# EAGLE schematic wzium (EAGLE 9.6.2)
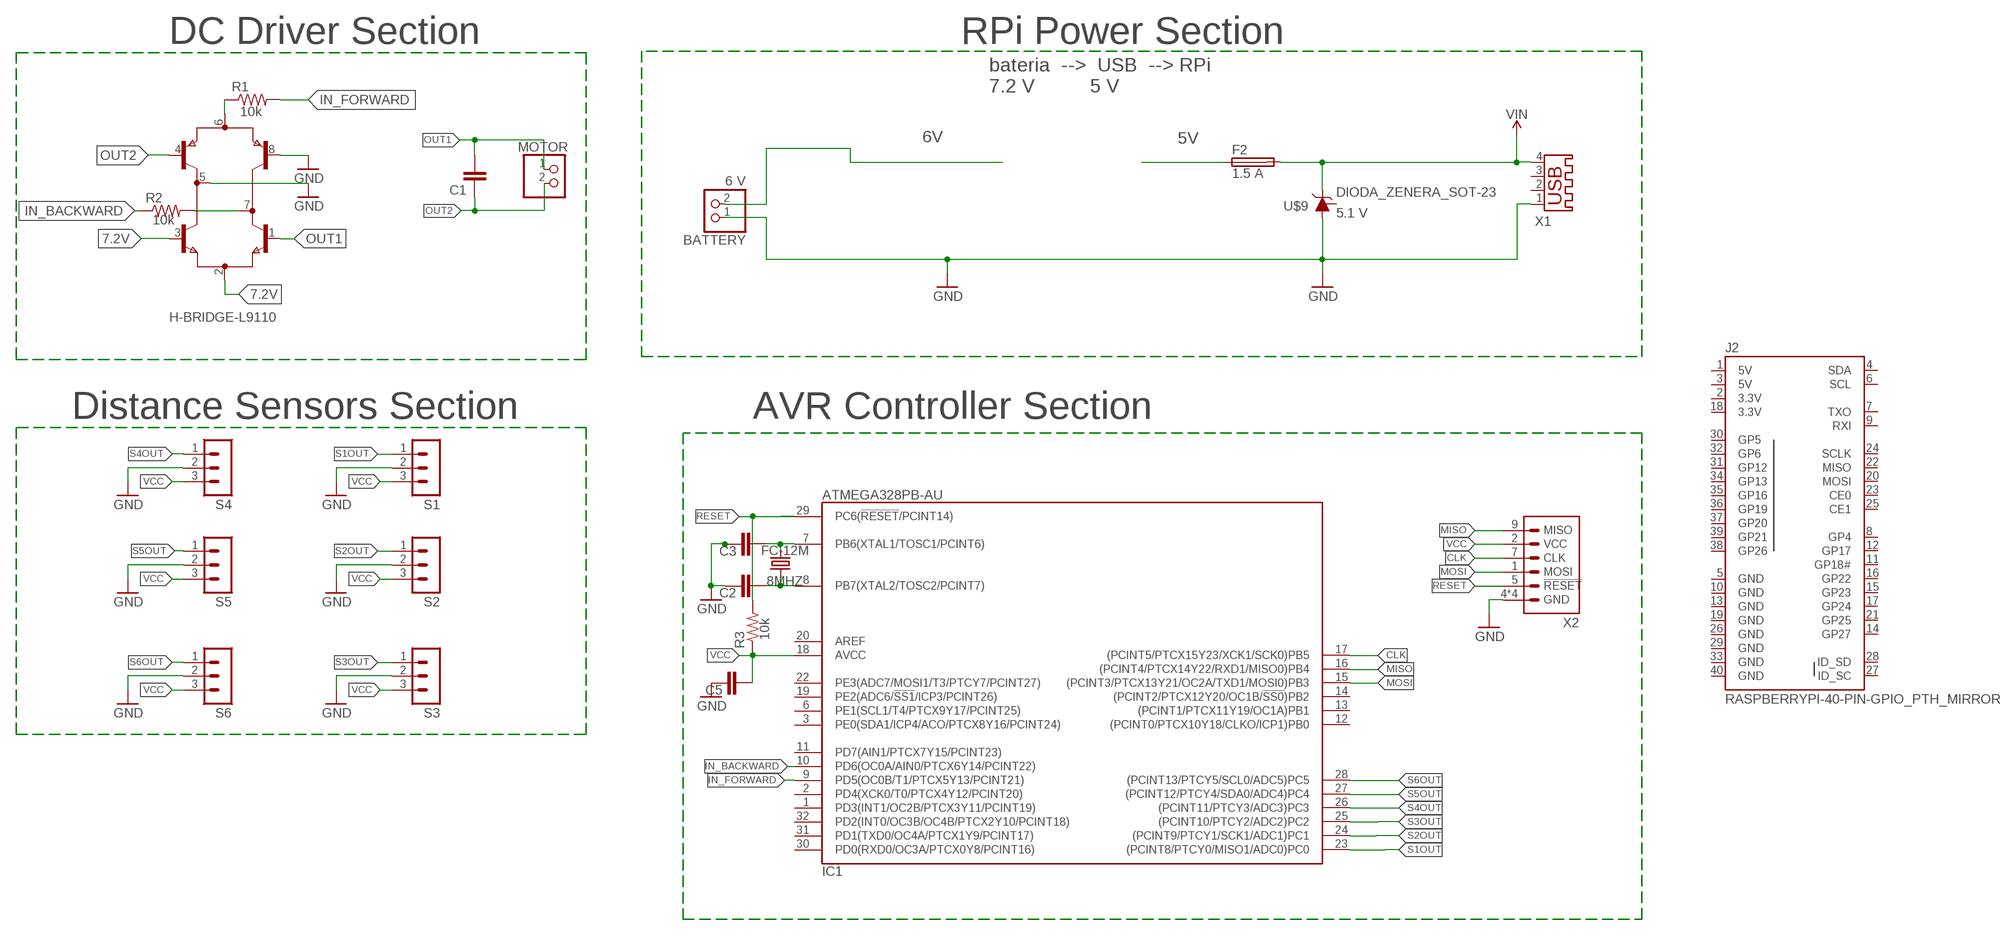
[diagram p0: schematic, sheet 1]

## Parts
8MHZ  FC-12M  [FC-12M]
BATTERY  6 V  PINHD-1X2  [1X02]
C1  C-EUC0805  [C0805]
C2  C-EUC0805  [C0805]
C3  C-EUC0805  [C0805]
C5  C-EUC0805  [C0805]
F2  1.5 A  SH22,5  [SH22,5]
H-BRIDGE-L9110  H-BRIDGE  [SM8]
IC1  ATMEGA328PB-AU  [QFP32_7X7_0.80]
J2  RASPBERRYPI-40-PIN-GPIO_PTH_MIRROR  [2X20_SHROUDED]
MOTOR  PINHD-1X2  [1X02]
R1  10k  R-US_R0805  [R0805]
R2  10k  R-US_R0805  [R0805]
R3  10k  R-US_R0805  [R0805]
S1  MA03-1  [MA03-1]
S2  MA03-1  [MA03-1]
S3  MA03-1  [MA03-1]
S4  MA03-1  [MA03-1]
S5  MA03-1  [MA03-1]
S6  MA03-1  [MA03-1]
U$9  DIODA_ZENERA_SOT-23  [SOT23-3]
X1  USB-A003  [USB-A003]
X2  MISO_MOSIIDC-10V  [IDC-10V]

## Nets
5V: F2.1
6V: BATTERY.2
7.2V: H-BRIDGE-L9110.2(E2E3) H-BRIDGE-L9110.3(B2)
CLK: IC1.17((PCINT5/PTCX15Y23/XCK1/SCK0)PB5) X2.7(CLK)
GND: BATTERY.1 C2.2 C3.2 C5.2 H-BRIDGE-L9110.5(C1C2) H-BRIDGE-L9110.8(B4) S1.2 S2.2 S3.2 S4.2 S5.2 S6.2 U$9.1(A) X1.1 X2.4(GND) X2.6(GND) X2.8(GND) X2.10(GND)
IN_BACKWARD: IC1.10(PD6(OC0A/AIN0/PTCX6Y14/PCINT22)) R2.1
IN_FORWARD: IC1.9(PD5(OC0B/T1/PTCX5Y13/PCINT21)) R1.2
MISO: IC1.16((PCINT4/PTCX14Y22/RXD1/MISO0)PB4) X2.9(MISO)
MOSI: IC1.15((PCINT3/PTCX13Y21/OC2A/TXD1/MOSI0)PB3) X2.1(MOSI)
N$3: H-BRIDGE-L9110.7(C3C4) R2.2
N$5: H-BRIDGE-L9110.6(E1E4) R1.1
N$7: 8MHZ.1 C3.1 IC1.7(PB6(XTAL1/TOSC1/PCINT6))
N$8: 8MHZ.2 C2.1 IC1.8(PB7(XTAL2/TOSC2/PCINT7))
OUT1: C1.2 H-BRIDGE-L9110.1(B3) MOTOR.1
OUT2: C1.1 H-BRIDGE-L9110.4(B1) MOTOR.2
RESET: IC1.29(PC6(!RESET!/PCINT14)) R3.2 X2.5(!RESET)
S1OUT: IC1.23((PCINT8/PTCY0/MISO1/ADC0)PC0) S1.1
S2OUT: IC1.24((PCINT9/PTCY1/SCK1/ADC1)PC1) S2.1
S3OUT: IC1.25((PCINT10/PTCY2/ADC2)PC2) S3.1
S4OUT: IC1.26((PCINT11/PTCY3/ADC3)PC3) S4.1
S5OUT: IC1.27((PCINT12/PTCY4/SDA0/ADC4)PC4) S5.1
S6OUT: IC1.28((PCINT13/PTCY5/SCL0/ADC5)PC5) S6.1
VCC: C5.1 IC1.18(AVCC) R3.1 S1.3 S2.3 S3.3 S4.3 S5.3 S6.3 X2.2(VCC)
VIN: F2.2 U$9.3(C) X1.4
Unconnected: IC1.1(PD3(INT1/OC2B/PTCX3Y11/PCINT19)) IC1.2(PD4(XCK0/T0/PTCX4Y12/PCINT20)) IC1.3(PE0(SDA1/ICP4/ACO/PTCX8Y16/PCINT24)) IC1.6(PE1(SCL1/T4/PTCX9Y17/PCINT25)) IC1.11(PD7(AIN1/PTCX7Y15/PCINT23)) IC1.12((PCINT0/PTCX10Y18/CLKO/ICP1)PB0) IC1.13((PCINT1/PTCX11Y19/OC1A)PB1) IC1.14((PCINT2/PTCX12Y20/OC1B/!SS0!)PB2) IC1.19(PE2(ADC6/!SS1!/ICP3/PCINT26)) IC1.20(AREF) IC1.22(PE3(ADC7/MOSI1/T3/PTCY7/PCINT27)) IC1.30(PD0(RXD0/OC3A/PTCX0Y8/PCINT16)) IC1.31(PD1(TXD0/OC4A/PTCX1Y9/PCINT17)) IC1.32(PD2(INT0/OC3B/OC4B/PTCX2Y10/PCINT18)) J2.4(SDA) J2.6(SCL) J2.7(TXO) J2.8(GP4) J2.9(RXI) J2.11(GP18#) J2.12(GP17) J2.14(GP27) J2.15(GP23) J2.16(GP22) J2.17(GP24) J2.20(MOSI) J2.21(GP25) J2.22(MISO) J2.23(CE0) J2.24(SCLK) J2.25(CE1) J2.27(ID_SC) J2.28(ID_SD) J2.30(GP5) J2.31(GP12) J2.32(GP6) J2.34(GP13) J2.35(GP16) J2.36(GP19) J2.37(GP20) J2.38(GP26) J2.39(GP21) U$9.2(ADJ) X1.2 X1.3

## Notes on the sheet
- DC Driver Section | RPi Power Section
- bateria  -->  USB  --> RPi
  7.2 V          5 V
- 5.1 V
- Distance Sensors Section | AVR Controller Section

## Power pins joined to a net without a drawn wire
3.3V: J2.2(3.3V) J2.18(3.3V)
5V: J2.1(5V) J2.3(5V)
GND: IC1.5(GND) IC1.21(GND) J2.5(GND) J2.10(GND) J2.13(GND) J2.19(GND) J2.26(GND) J2.29(GND) J2.33(GND) J2.40(GND)
VCC: IC1.4(VCC)

## Library data of the parts
8MHZ = crystal:FC-12M: kHz RANGE CRYSTAL UNIT LOW PROFILE SMD Source: Epson Toyocom FC-12M.pdf
BATTERY MOTOR = DC_LOAD_AU:PINHD-1X2: PIN HEADER
C1-C3 C5 = rcl:C-EU: CAPACITOR, European symbol; SPICEPREFIX: C
F2 = fuse:SH22,5: FUSE HOLDER grid 22,5 mm, OGN0031 8201, Schurter (Buerklin); MF: SCHURTER; MPN: 0031.8201; OC_FARNELL: 1162740; OC_NEWARK: 96F8317
H-BRIDGE-L9110 = zetex:H-BRIDGE: BRIDGE; OC_FARNELL: unknown; OC_NEWARK: unknown
IC1 = atmel:ATMEGA328PB: 8-bit AVR Microcontroller 32kbytes flash 2kbytes SRAM 1kbyte EEPROM USART 8-channel 10 bit ADC
J2 = _Raspberry_Pi:RASPBERRYPI-40-PIN-GPIO: Raspberry Pi GPIO Header 2x20 pin connector, as found on B, B+, A+ models. Both shrouded PTH and SMT versions available. SparkFun Products: GPIO Shrouded Header <https://www.sparkfun.com/products/13054>- PTH SparkFun Pi Wedge (Preassembled) <https://www.sparkfun.com/products/13717>; PROD_ID: CONN-12263; SF_ID: PRT-13054
R1-R3 = rcl:R-US_: RESISTOR, American symbol; SPICEPREFIX: R
S1-S6 = con-lstb:MA03-1: PIN HEADER; OC_FARNELL: unknown; OC_NEWARK: unknown
U$9 = SparkFun-DiscreteSemi:DIODA_ZENERA_SOT-23
X1 = con-yamaichi:USB-A003: USB connector; OC_FARNELL: unknown; OC_NEWARK: unknown
X2 = atmel:MISO_MOSI: MISO/MOSI Programmer Interface refere to Atmel/Microchip description of pin header style <http://microchipdeveloper.com/atmelice:connecting-atmel-ice-to-a-debugwire-target>